# Altium schematic sheet POWER.SchDoc
size A; SheetNumber: 2; SheetTotal: 5
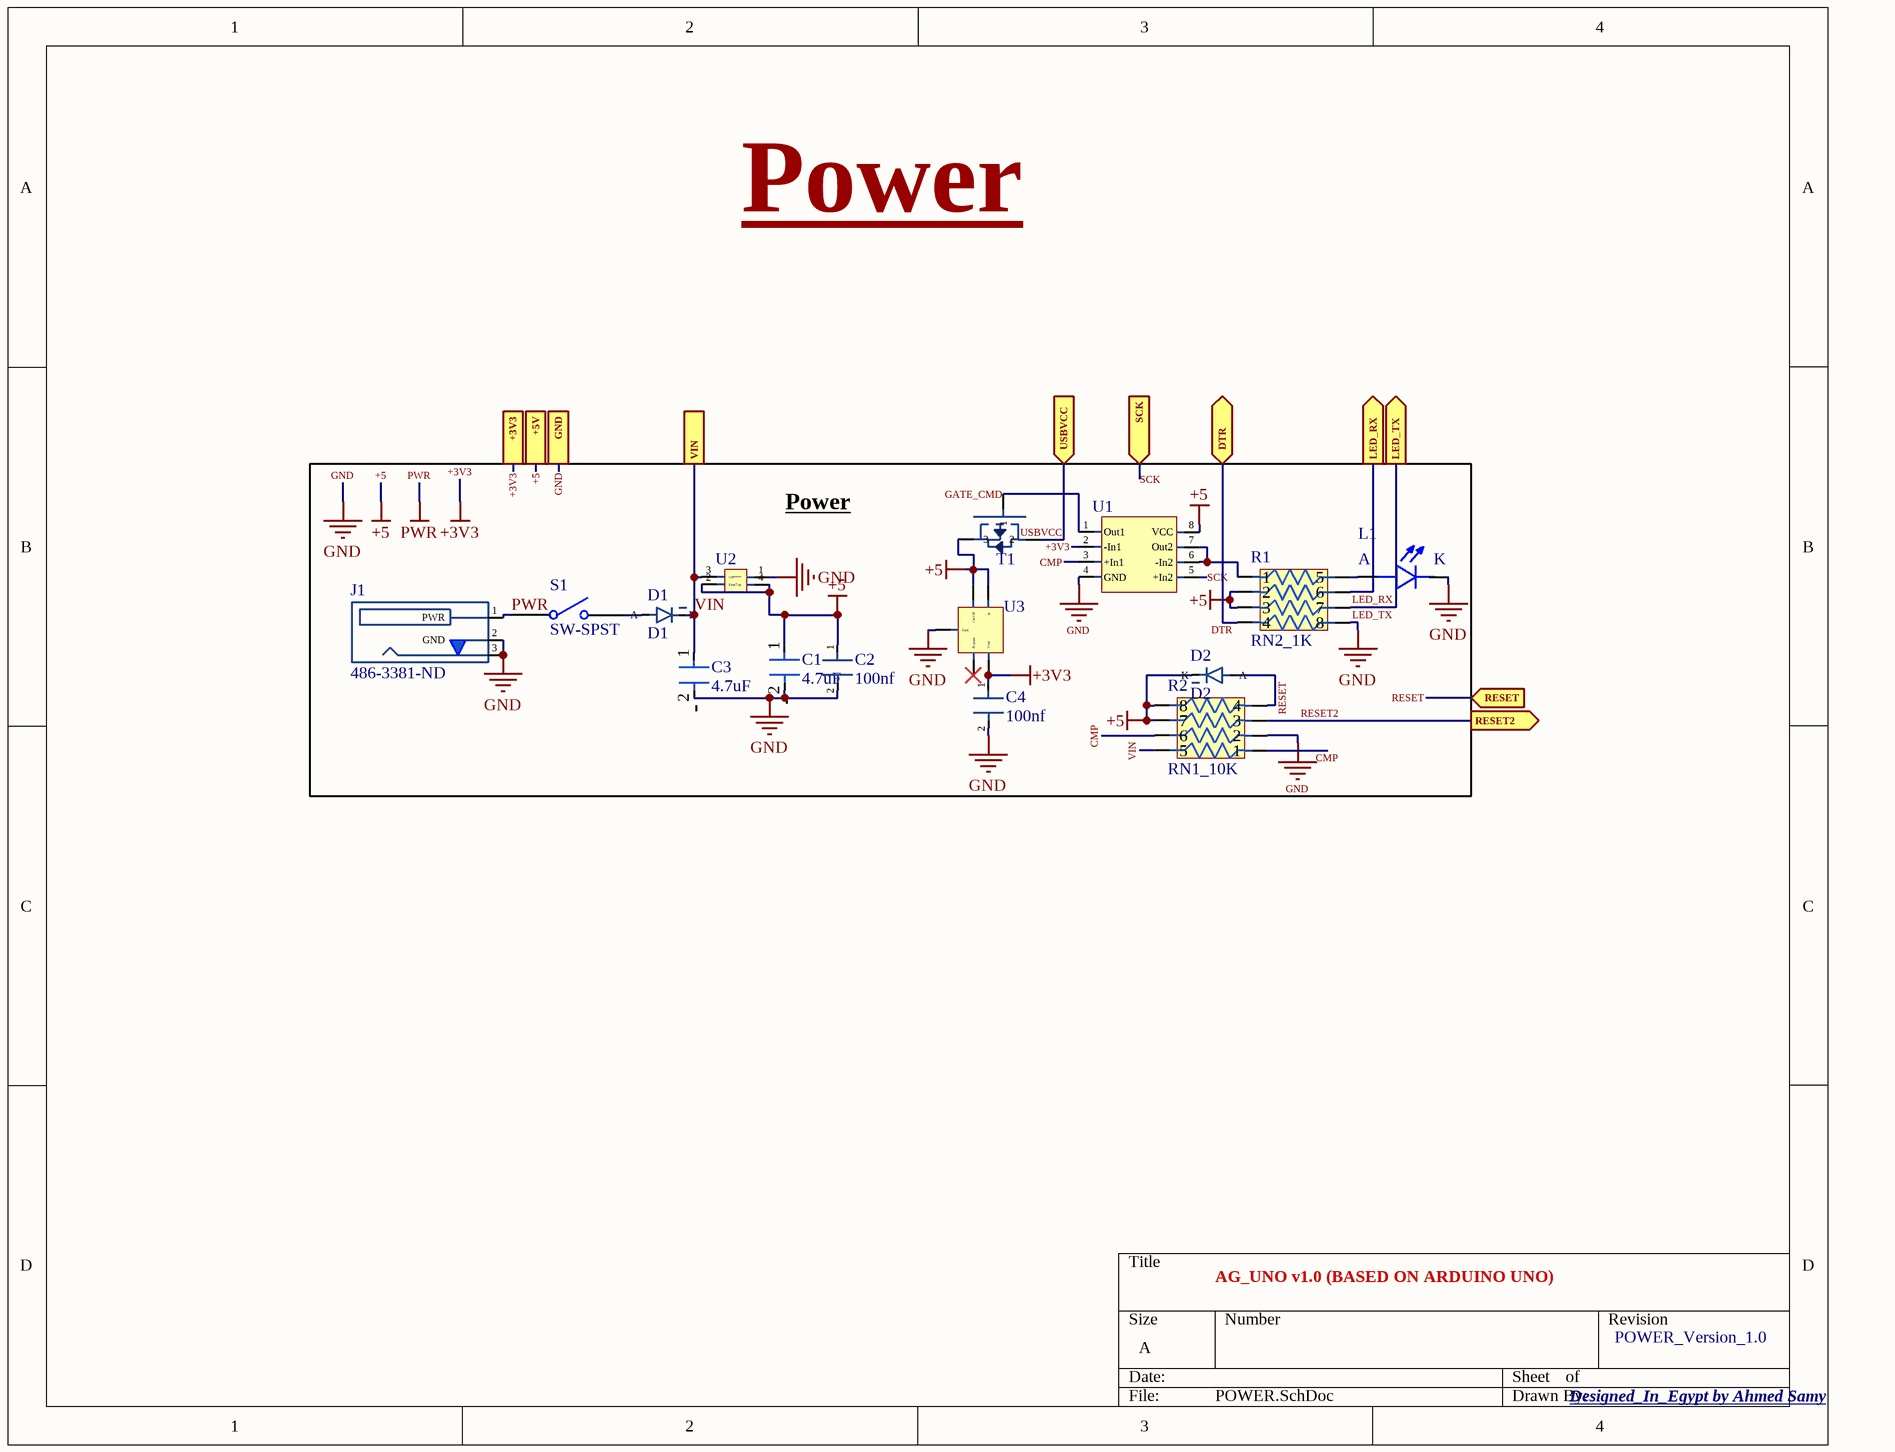
[diagram p0: POWER.SchDoc]

## Parts
C1  4.7uF  [P16437CT-ND]
C2  100nf  [CC0603KRX7R7BB105]
C3  4.7uF  [P16437CT-ND]
C4  100nf  [CC0603KRX7R7BB105]
D1  D1  [CGRA4007-G]
D2  D2  [CD1206-S01575]
J1  486-3381-ND  [486-3381-ND]
L1  LED_OPAMP  [LED_Q62702P5179]  (value not drawn)
R1  RN2_1K  [CAY16-103J4GLF]
R2  RN1_10K  [CAY16-103J4GLF]
S1  SW-SPST  [SPST-2]
T1  IRLML6402TRPBF  [IRLML6402TRPBF]  (value not drawn)
U1  LMV358LIST  [LMV358LIST]  (value not drawn)
U2  SPX1117M3-L-5-0/TR  [SPX1117M3-L-5-0/TR]  (value not drawn)
U3  LP2985-33DBVR  [LP2985-33DBVR]  (value not drawn)

## Ports
+3V3, +5V, DTR (bidir), GND, LED_RX (out), LED_TX (out), RESET2 (out), RESET (in), SCK (in), USBVCC (in), VIN

## Nets
+3V3: C4.1 U1.2(-In1) U3.5(Vout) ; port +3V3
+5: C1.1 C2.1 D2.1(K) R1.2 R1.3 R2.7 R2.8 T1.3 U1.8(VCC) U2.2(Vout) U2.4(Tap) U3.1(In) U3.3(On/Off) ; port +5V
GND: C1.2(-) C2.2 C3.2(-) C4.2 J1.2(GND) J1.3 L1.C R1.8 R2.2 U1.4(GND) U2.1(GND/ADJ) U3.2(Gnd) ; port GND
PWR: J1.1(PWR) S1.1(COMMON)
CMP: R2.1 R2.6 U1.3(+In1)
DTR: R1.4 ; port DTR
GATE_CMD: T1.1 U1.1(Out1)
LED_RX: R1.6 ; port LED_RX
LED_TX: R1.7 ; port LED_TX
RESET: D2.2(A) R2.4 ; port RESET
RESET2: R2.3 ; port RESET2
SCK: U1.5(+In2) ; port SCK
USBVCC: T1.2 ; port USBVCC
VIN: C3.1 D1.1(K) R2.5 U2.3(Vin) ; port VIN
NetD1_2: D1.2(A) S1.2(NO)
NetL1_A: L1.A R1.5
NetR1_1: R1.1 U1.6(-In2) U1.7(Out2)

Not connected (* = marked no-connect by the designer): U3 4(Bypass)*

## Notes on the sheet
- Power
- AG_UNO v1.0 (BASED ON ARDUINO UNO)
- POWER_Version_1.0
- Designed_In_Egypt by Ahmed Samy
- (in symbol LED_Q62702P5179) K

## Library data of the parts
C1 C3 = P16437CT-ND: CAP ALUM POLY 4.7UF 20% 10V SMD
C2 C4 = CC0603KRX7R7BB105: 1 µF ±10% 16V Ceramic Capacitor X7R 0603 (1608 Metric)
D1 = CGRA4007-G: Diode 1000 V 1A Surface Mount DO-214AC (SMA) [used in UNO]
D2 = CD1206-S01575: Diode 100 V 150mA Surface Mount 1206 [D2 UNO]
J1 = 486-3381-ND: Power Barrel Connector Jack 2.10mm ID (0.083"), 5.50mm OD (0.217") Through Hole, Right Angle
L1 = LED_Q62702P5179: LED 0805
R1 R2 = CAY16-103J4GLF: 10k Ohm ±5% 62.5mW Power Per Element Isolated 4 Resistor Network/Array ±200ppm/°C 1206 (3216 Metric), Convex, Long Side Terminals
S1 = SW-SPST: Single-Pole, Single-Throw Switch; Published: 24-Mar-1999; LatestRevisionDate: 17-Jul-2002; LatestRevisionNote: Re-released for DXP Platform.; PackageReference: SPST-2; Publisher: Altium Limited; PackageDescription: Switch; 2 Leads
T1 = IRLML6402TRPBF: P-Channel 20 V 3.7A (Ta) 1.3W (Ta) Surface Mount Micro3™/SOT-23
U1 = LMV358LIST: General Purpose Amplifier 2 Circuit Rail-to-Rail 8-MiniSO
U2 = SPX1117M3-L-5-0/TR: Linear Voltage Regulator IC Positive Fixed 1 Output 800mA SOT-223-3
U3 = LP2985-33DBVR: Linear Voltage Regulator IC Positive Fixed 1 Output 150mA SOT-23-5